# EAGLE design AuxSensor_Breakout (EAGLE 9.6.2)
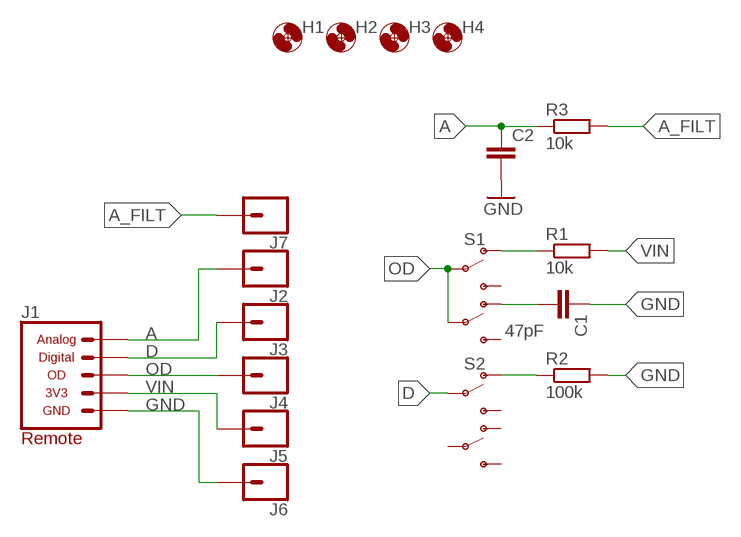
[diagram p0: schematic, sheet 1]

## Parts
C1  47pF  C-EUC0805  [C0805]
C2  C-EU0.1UFC0805  [C0805]
H1  MOUNTING_HOLE4_NP  [4_40]
H2  MOUNTING_HOLE4_NP  [4_40]
H3  MOUNTING_HOLE4_NP  [4_40]
H4  MOUNTING_HOLE4_NP  [4_40]
J1  CONN_AUX_M12_REMOTE  [1X05_M12_TE_T41410]
J2  CONN_BANANA_SOLDER  [CON_BANANA_575-4]
J3  CONN_BANANA_SOLDER  [CON_BANANA_575-4]
J4  CONN_BANANA_SOLDER  [CON_BANANA_575-4]
J5  CONN_BANANA_SOLDER  [CON_BANANA_575-4]
J6  CONN_BANANA_SOLDER  [CON_BANANA_575-4]
J7  CONN_BANANA_SOLDER  [CON_BANANA_575-4]
R1  10k  R-EU_10KR0805  [R0805]
R2  100k  R-EU_100KR0805  [R0805]
R3  10k  R-EU_10KR0805  [R0805]
S1  SWITCH_DPDTJS_GULLWING  [JS202011SCQN]
S2  SWITCH_DPDTJS_GULLWING  [JS202011SCQN]

## Nets
A: C2.1 J1.4(ANALOG) J2.P$1 R3.1
A_FILT: J7.P$1 R3.2
D: J1.5(DIGITAL) J3.P$1 S2.2(P1)
GND: C1.1 C2.2 J1.3(GND) J6.P$1 R2.2
N$1: C1.2 S1.6(O2)
N$3: R2.1 S2.1(O1)
N$6: R1.1 S1.1(O1)
OD: J1.2(DIGITAL_OPENDRAIN) J4.P$1 S1.2(P1) S1.5(P2)
VIN: J1.1(3V3) J5.P$1 R1.2
Unconnected: S1.3(S1) S1.4(S2) S2.3(S1) S2.4(S2) S2.5(P2) S2.6(O2)

## Library data of the parts
C1 = bschulz_passives:C-EU: CAPACITOR, European symbol
C2 = bschulz_passives:C-EU: CAPACITOR, European symbol; DIGIKEY: 399-8000-1-ND; MF: Kemet; MPN: C0805C104M3RACTU
H1-H4 = bschulz:MOUNTING_HOLE: Genaric Mechanical Mounting Hole Hole diameter based on max body diameter + 15% Keepout ring is for diameter of socket cap screw (minimum required clearance) TPlace ring is for diameter of pan head screw (recomended clearance) Specifications: Socket Cap <http://fastener-express.com/fastener-technical/SocketscapSS-Alloy.pdf> Button Head Socket Cap <http://fastener-express.com/fastener-technical/Button-Socket-alloy.pdf> Pan Head <http://fastener-express.com/fastener-technical/pan-machine-Screws.pdf>; DIGIKEY: DNP; MF: N/A; MPN: DNP
J1 = GEMS_Plugs:CONN_AUX: GEMS Connector for Auiliary Port Devices; DIGIKEY: A126851-ND; DISP: Remote; MF: TE; MPN: T4141012051-000
J2-J7 = bschulz:CONN_BANANA: PCB Connectors for Banana Plugs
R1 R3 = bschulz_passives:R-EU_: RESISTOR, European symbol Digikey Parts: Yageo, 0402 <https://www.digikey.com/products/en/resistors/chip-resistor-surface-mount/52?k=&pkeyword=&sv=0&s=4356&sf=1&FV=-1%7C13%2C7%7C2%2C1291%7C39157%2C1989%7C0%2C-8%7C52%2C3%7C1131%2C3%7C2503&quantity=&ColumnSort=0&page=1&stock=1&pageSize=25> Yageo, 0603 <https://www.digikey.com/products/en/resistors/chip-resistor-surface-mount/52?k=&pkeyword=&sv=0&pv1291=39245&sf=1&FV=-5%7C4356%2C-5%7C47360%2C-8%7C52%2C-1%7C13%2C7%7C2%2C1989%7C0&quantity=10&ColumnSort=1000011&page=1&stock=1&pageSize=25> Panasonic, 0603 <https://www.digikey.com/products/en/resistors/chip-resistor-surface-mount/52?k=&pkeyword=&pv252=68&sf=0&FV=ffec373d%2C1c0002%2C142c040c%2C1f140000%2Cffe00034%2C80002%2Cc0001&quantity=&ColumnSort=0&page=1&stock=1&pageSize=25> Panasonic, precision, 0603 <https://www.digikey.com/products/en/resistors/chip-resistor-surface-mount/52?FV=ffec4907%2Cfffc000a%2Cc0172%2C142c040c%2C1f140000%2Cffe00034%2C1c0002&quantity=100&ColumnSort=2085&page=1&stock=1&pageSize=25> Panasonic, 0805 <https://www.digikey.com/products/en/resistors/chip-resistor-surface-mount/52?k=&pkeyword=&pv3=1&sf=0&FV=ffec373d%2C1c0002%2C1f140000%2Cffe00034%2C142c040d&quantity=&ColumnSort=0&page=1&stock=1&pageSize=25> Rohm, current sense <https://www.digikey.com/products/en/resistors/chip-resistor-surface-mount/52?k=&pkeyword=&pv3=1&sf=0&FV=ffecb688%2C1f140000%2Cffe00034%2C1c0002&quantity=&ColumnSort=0&page=1&stock=1&pageSize=25> Vishay, pulse proof automotive <https://www.digikey.com/products/en/resistors/chip-resistor-surface-mount/52?k=&pkeyword=&pv7=2&sf=0&FV=ffec5d6b%2Cffe00034%2C1f140000&quantity=&ColumnSort=0&page=1&stock=1&pageSize=25>; DIGIKEY: 311-10.0KCRCT-ND; MF: Yageo; MPN: RC0805FR-0710KL
R2 = bschulz_passives:R-EU_: RESISTOR, European symbol Digikey Parts: Yageo, 0402 <https://www.digikey.com/products/en/resistors/chip-resistor-surface-mount/52?k=&pkeyword=&sv=0&s=4356&sf=1&FV=-1%7C13%2C7%7C2%2C1291%7C39157%2C1989%7C0%2C-8%7C52%2C3%7C1131%2C3%7C2503&quantity=&ColumnSort=0&page=1&stock=1&pageSize=25> Yageo, 0603 <https://www.digikey.com/products/en/resistors/chip-resistor-surface-mount/52?k=&pkeyword=&sv=0&pv1291=39245&sf=1&FV=-5%7C4356%2C-5%7C47360%2C-8%7C52%2C-1%7C13%2C7%7C2%2C1989%7C0&quantity=10&ColumnSort=1000011&page=1&stock=1&pageSize=25> Panasonic, 0603 <https://www.digikey.com/products/en/resistors/chip-resistor-surface-mount/52?k=&pkeyword=&pv252=68&sf=0&FV=ffec373d%2C1c0002%2C142c040c%2C1f140000%2Cffe00034%2C80002%2Cc0001&quantity=&ColumnSort=0&page=1&stock=1&pageSize=25> Panasonic, precision, 0603 <https://www.digikey.com/products/en/resistors/chip-resistor-surface-mount/52?FV=ffec4907%2Cfffc000a%2Cc0172%2C142c040c%2C1f140000%2Cffe00034%2C1c0002&quantity=100&ColumnSort=2085&page=1&stock=1&pageSize=25> Panasonic, 0805 <https://www.digikey.com/products/en/resistors/chip-resistor-surface-mount/52?k=&pkeyword=&pv3=1&sf=0&FV=ffec373d%2C1c0002%2C1f140000%2Cffe00034%2C142c040d&quantity=&ColumnSort=0&page=1&stock=1&pageSize=25> Rohm, current sense <https://www.digikey.com/products/en/resistors/chip-resistor-surface-mount/52?k=&pkeyword=&pv3=1&sf=0&FV=ffecb688%2C1f140000%2Cffe00034%2C1c0002&quantity=&ColumnSort=0&page=1&stock=1&pageSize=25> Vishay, pulse proof automotive <https://www.digikey.com/products/en/resistors/chip-resistor-surface-mount/52?k=&pkeyword=&pv7=2&sf=0&FV=ffec5d6b%2Cffe00034%2C1f140000&quantity=&ColumnSort=0&page=1&stock=1&pageSize=25>; DIGIKEY: 311-100KCRCT-ND; MF: Yageo; MPN: RC0805FR-07100KL
S1 S2 = bschulz:SWITCH_DPDT: Genric DPDT Switch; DIGIKEY: 401-2002-1-ND; MF: C&K; MPN: JS202011SCQN

## Board
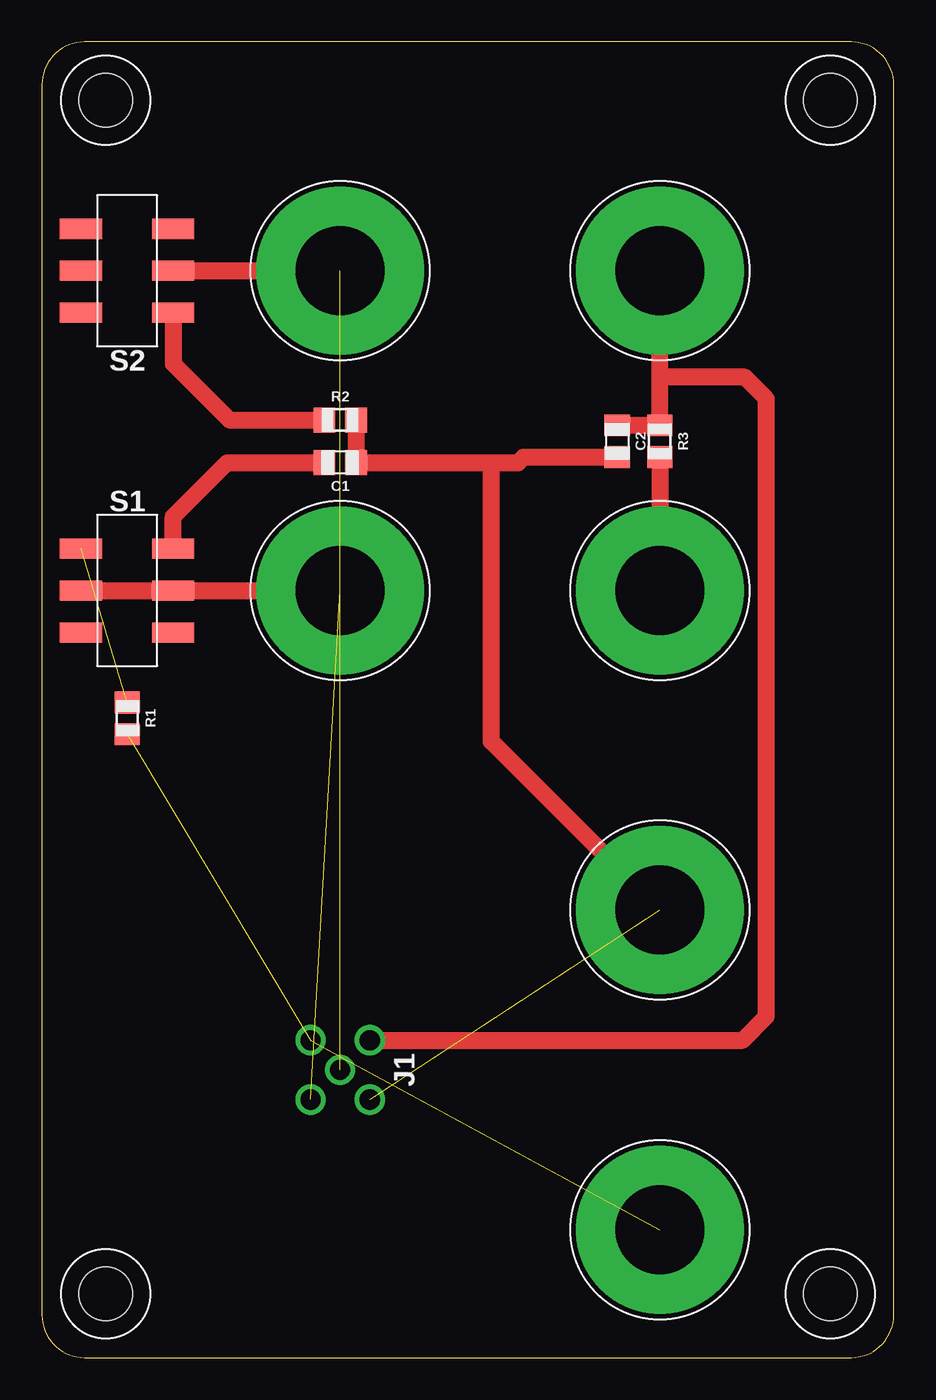
[diagram p1: board, top side]
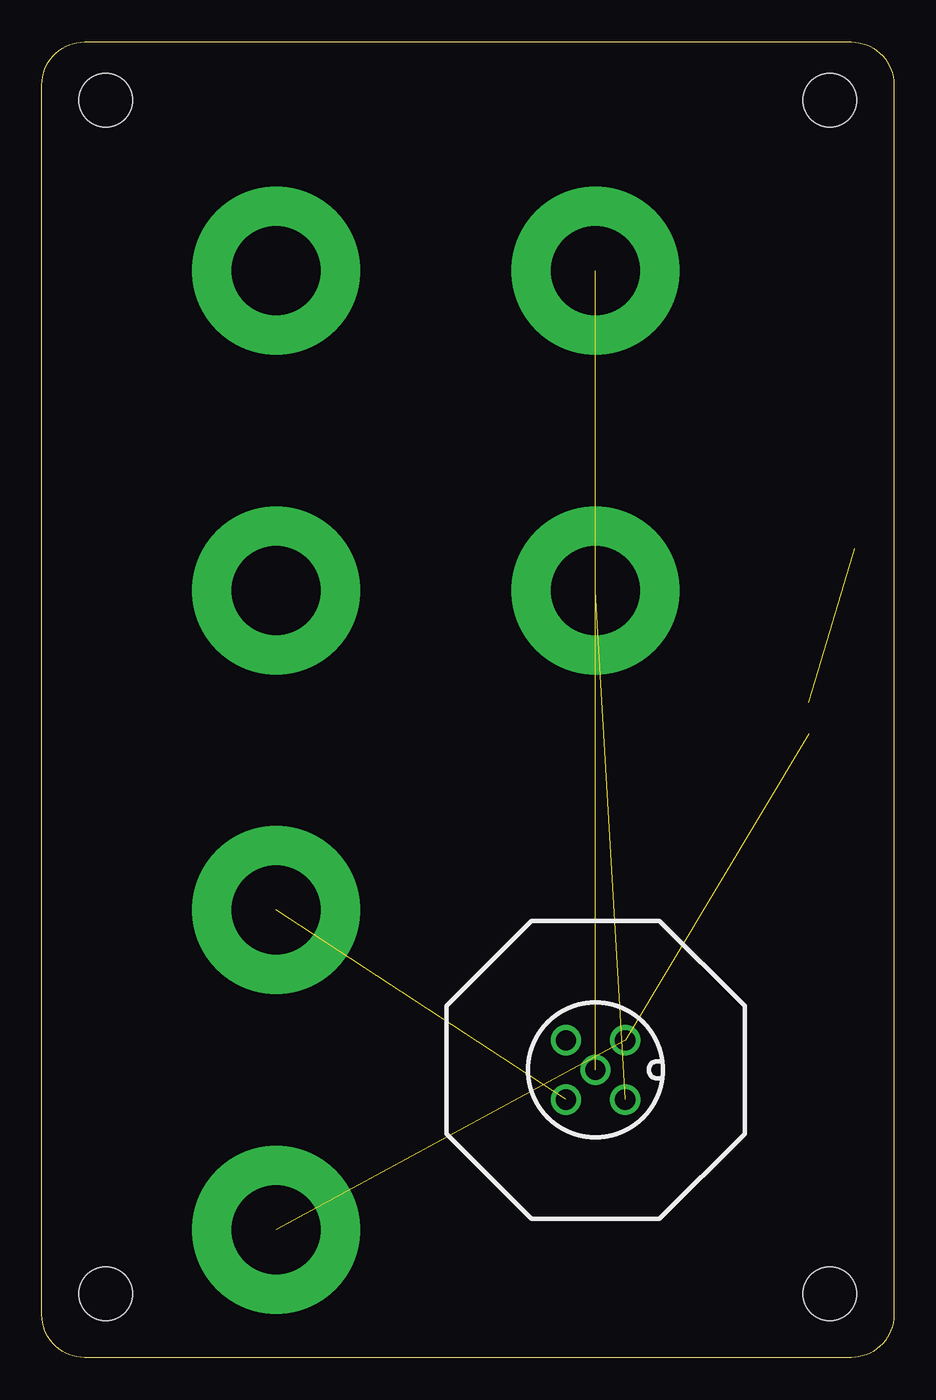
[diagram p2: board, bottom side, seen from below]

Size 50.78 x 78.41 mm. Coordinates in mm from the lower left corner, seen from the top.
Outline: 0,75.87 0,2.54 arc90 2.54,0 48.24,0 arc90 50.78,2.54 50.78,75.87 arc90 48.24,78.41 2.54,78.41 arc90 0,75.87
Copper layers (1*16): Top 0.035mm / dielectric 1.5mm / Bottom 0.035mm
Design rules "default": minimum track width 6mil, minimum drill 0.35mm, track to track 6mil, track to pad 6mil, pad to pad 6mil, via to via 6mil, smd to smd 6mil, copper to edge 40mil, drill to drill 6mil, minimum pad ring 10mil, minimum via ring 8mil, stop-mask expansion 4mil, vias tented up to drill 0mil, thermal gap 10mil

### Footprints (pad centres in the part's own frame; a part is rotated, then mirrored left to right if it is on the bottom)
C0805 = smd 1.3 x 1.5: 1 -0.95,0; 2 0.95,0
4_40 = hole 3.175: 0,0
1X05_M12_TE_T41410 = drill 1.2: 1 1.768,1.768; 2 -1.768,1.768; 3 -1.768,-1.768; 4 1.768,-1.768; 5 0,0
CON_BANANA_575-4 = drill 5.3 pad 10: P$1 0,0
R0805 = smd 1.3 x 1.5: 1 -0.95,0; 2 0.95,0
JS202011SCQN = smd 1.2 x 2.515: 1 -2.5,-2.75; 2 0,-2.75; 3 2.5,-2.75; 4 2.5,2.75; 5 0,2.75; 6 -2.5,2.75

### Placement (x,y rotation side)
C1  17.78,53.34 180 top
C2  34.29,54.61 270 top
H1  3.81,3.81 0 top
H2  46.99,74.93 0 top
H3  3.81,74.93 0 top
H4  46.99,3.81 0 top
J1  17.78,17.14 90 top
J2  36.83,64.77 0 top
J3  17.78,64.77 0 top
J4  17.78,45.72 0 top
J5  36.83,7.62 0 top
J6  36.83,26.67 0 top
J7  36.83,45.72 0 top
R1  5.08,38.1 270 top
R2  17.78,55.88 0 top
R3  36.83,54.61 270 top
S1  5.08,45.72 270 top
S2  5.08,64.77 90 top

### Tracks (layer width: path | path; a pad name or v marks a point on that pad's centre or on a via)
A
  Top 1.016: J1.4 41.77,18.91 43.18,20.32 43.18,57.15 41.91,58.42 36.83,58.42 | 36.83,58.42 R3.1 C2.1 | 36.83,58.42 J2.P$1
A_FILT
  Top 1.016: R3.2 J7.P$1
D  (1 unrouted)
  Top 1.016: S2.2 J3.P$1
GND  (1 unrouted)
  Top 1.016: R2.2 C1.1 26.8,53.34 | 26.8,53.34 28.38,53.34 28.7,53.66 C2.2 | J6.P$1 26.8,36.7 26.8,53.34
N$1
  Top 1.016: S1.6 7.83,50.12 11.04,53.34 C1.2
N$3
  Top 1.016: S2.1 7.83,59.23 11.18,55.88 R2.1
N$6  (1 unrouted)
OD  (1 unrouted)
  Top 1.016: S1.2 S1.5 J4.P$1
VIN  (2 unrouted)